# Altium schematic sheet [10]-MAIN_POWER.SchDoc
size A4
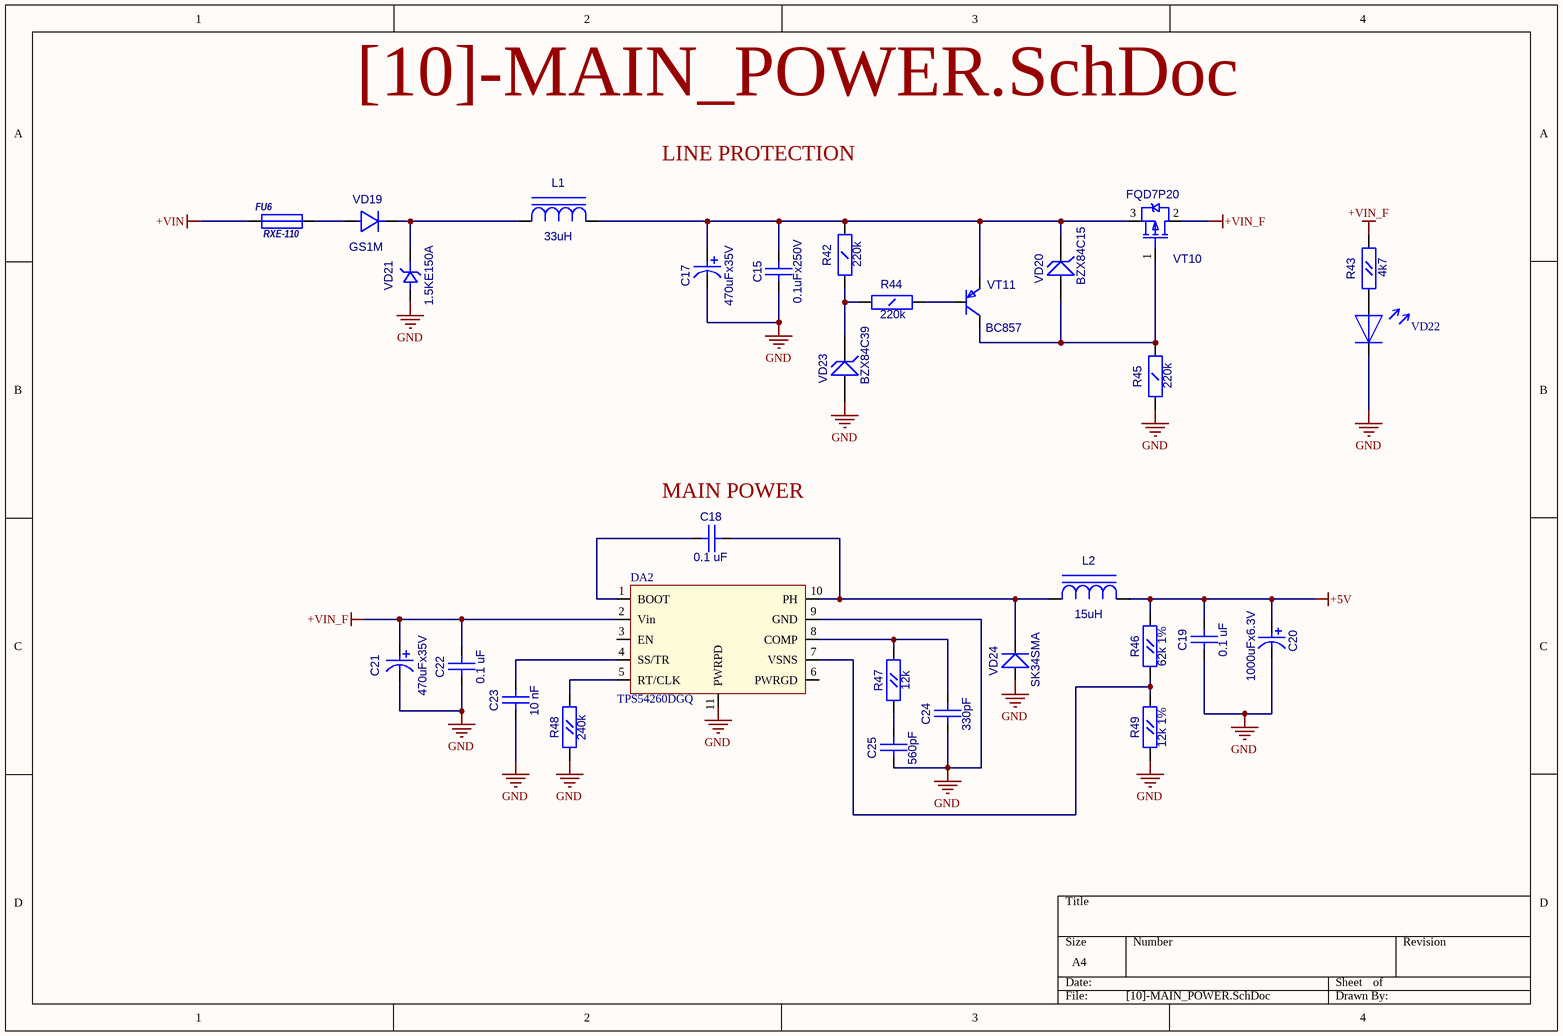
[diagram p0: [10]-MAIN_POWER.SchDoc]

## Parts
C15  0.1uFx250V  [CC1206]
C17  value 470uFx35V  [CC16X10_CAP0.5(1)(Primary)]  (hidden comment: CAP0.5(1))
C18  0.1 uF  [CC0603]
C19  0.1 uF  [CC0603]
C20  1000uFx6.3V  [CC8X3.5]
C21  470uFx35V  [CC16X10_CAP0.5(1)(Primary)]
C22  0.1 uF  [CC0603]
C23  10 nF  [CC0603]
C24  330pF  [CC0603]
C25  560pF  [CC0603]
DA2  TPS54260DGQ  [S-PDSO-G10]
FU6  RXE-110  [RXE-110]
L1  value 33uH  [SDR0805]  (hidden comment: SDR0805)
L2  15uH  [SDR0805]
R42  220k  [RC1206]
R43  4k7  [RC0603]
R44  220k  [RC1206]
R45  220k  [RC1206]
R46  62k 1%  [RC0603]
R47  12k  [RC0603]
R48  240k  [RC0603]
R49  12k 1%  [RC0603]
VD19  GS1M  [SMA]
VD20  BZX84C15  [SOT-23(123)]
VD21  1.5KE150A  [DO-201]
VD22  LED_0805  [LED0805]  (value not drawn)
VD23  BZX84C39  [SOT-23(123)]
VD24  SK34SMA  [SMA]
VT10  FQD7P20  [D-PAK(TO-252AA)]
VT11  BC857  [SOT-23(123)]

## Nets
+5V: C19.1(A) C20.1 L2.2(A) R46.2(B)
+VIN: FU6.1
+VIN_F: C21.2 C22.1(A) DA2.2(Vin) R43.2(B) VT10.2(D)
GND: C15.1(A) C17.1 C19.2(B) C20.2 C21.1 C22.2(B) C23.2(B) C24.2(B) C25.2(B) DA2.9(GND) DA2.11(PWRPD) R45.1(A) R48.1(A) R49.1(A) VD21.1(A) VD22.2 VD23.1(A) VD24.1(A)
NetC15_2: C15.2(B) C17.2 L1.2(A) R42.2(B) VD20.3(K) VT10.3(S) VT11.2(E)
NetC18_1: C18.1(A) DA2.10(PH) L2.1(C) VD24.2(K)
NetC18_2: C18.2(B) DA2.1(BOOT)
NetC23_1: C23.1(A) DA2.4(SS/TR)
NetC24_1: C24.1(A) DA2.8(COMP) R47.2(B)
NetC25_1: C25.1(A) R47.1(A)
NetDA2_5: DA2.5(RT/CLK) R48.2(B)
NetDA2_7: DA2.7(VSNS) R46.1(A) R49.2(B)
NetFU6_2: FU6.2 VD19.1(A)
NetL1_1: L1.1(C) VD19.2(K) VD21.2(K)
NetR42_1: R42.1(A) R44.1(A) VD23.3(K)
NetR43_1: R43.1(A) VD22.1
NetR44_2: R44.2(B) VT11.1(B)
NetR45_2: R45.2(B) VD20.1(A) VT10.1(G) VT11.3(C)

Not connected (* = marked no-connect by the designer): DA2 3(EN) 6(PWRGD)

## Notes on the sheet
- LINE PROTECTION
- (near C18) MAIN POWER

## Library data of the parts
C15 = CC1206: Value: 0.1uFx250V
C18 C19 C22-C25 = CC0603
  C18 C19 C22: Value: 0.1 uF
  C23: Value: 10 nF
  C24: Value: 330pF
  C25: Value: 560pF
C20 = CAP0.35: Value: 1000uFx6.3V
C21 = CAP0.5(1): Value: 470uFx35V
L2 = SDR0805: Value: 15uH
R42 R44 R45 = RC1206: Value: 220k
R43 R46-R49 = RC0603
  R43: Value: 4k7
  R46: Value: 62k 1%
  R47: Value: 12k
  R48: Value: 240k
  R49: Value: 12k 1%
VD19 = GS1M: Value: {Value}
VD20 VD23 = BZX84: Zener Voltage Regulator Diode
  VD20: Value: BZX84C15
  VD23: Value: BZX84C39
VD21 = 1.5KE: Value: 1.5KE150A
VD24 = SK34SMA: Schottky Rectifier; Value: {Value}
VT10 = IRFR9220: HEXFET Power MOSFET; OriginalName: IRLML5103; ComponentField7: Published 8-Jun-2000; Value: FQD7P20
VT11 = BC857B: PNP 100ma transistor; OriginalName: BC846BLT1; ComponentField7: Published 29-Sep-2000; Value: BC857
FU6 = RXE-110: Value: *
VD22 = LED_0805: Value: LED_0805